# Altium schematic sheet DigitalVoltage_SignalConditioning.SchDoc
size A4; CompanyName: Technische Hochschule Nürnberg Georg Simon Ohm; Address1: Fürther Straße 250; Address2: 90429 Nürnberg; Address3: GERMANY; CompanyName2: Institut ELSYS
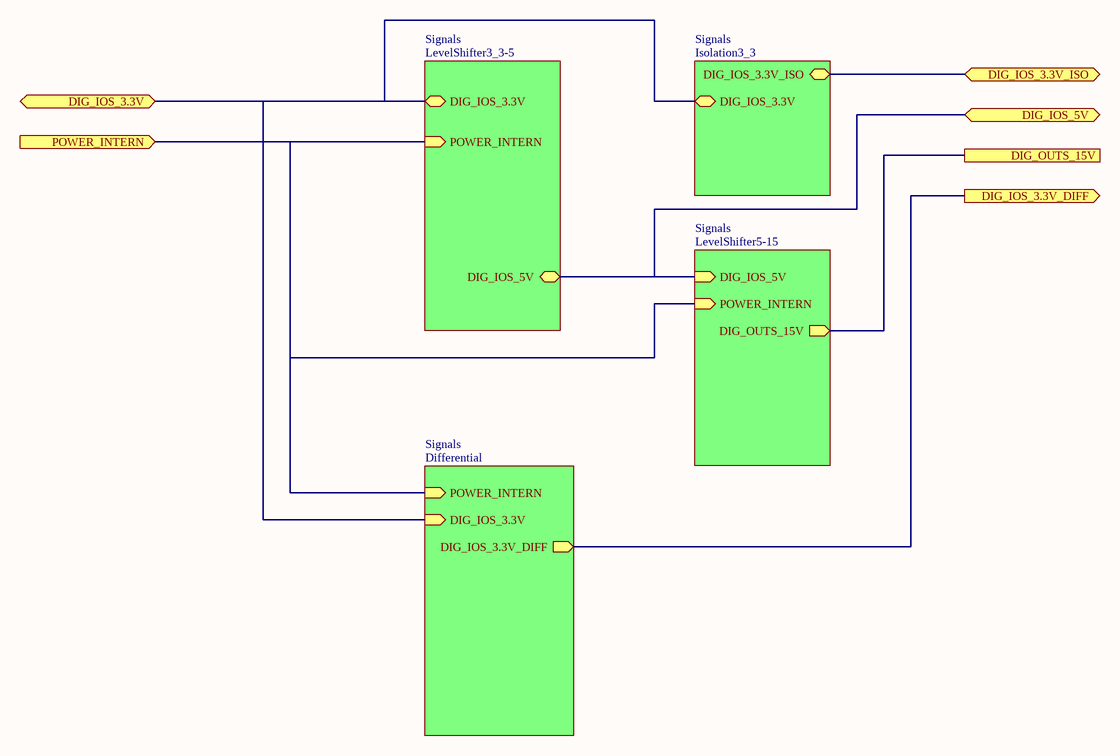
[diagram p0: DigitalVoltage_SignalConditioning.SchDoc]

## Sub-sheets
Signals = LevelShifter3_3-5: DIG_IOS_3.3V (bidir), POWER_INTERN (in), DIG_IOS_5V (bidir)
Signals = LevelShifter5-15: DIG_IOS_5V (in), POWER_INTERN (in), DIG_OUTS_15V (out)
Signals = Differential: POWER_INTERN (in), DIG_IOS_3.3V (in), DIG_IOS_3.3V_DIFF (out)
Signals = Isolation3_3: DIG_IOS_3.3V_ISO (bidir), DIG_IOS_3.3V (bidir)

## Ports
DIG_IOS_3.3V (bidir), DIG_IOS_3.3V_DIFF (out), DIG_IOS_3.3V_ISO (bidir), DIG_IOS_5V (bidir), DIG_OUTS_15V, POWER_INTERN (in)

## Buses and harness runs
bus port DIG_IOS_3.3V = sheet Signals/DIG_IOS_3.3V
bus port DIG_IOS_3.3V_DIFF = sheet Signals/DIG_IOS_3.3V_DIFF
bus port DIG_IOS_3.3V_ISO = sheet Signals/DIG_IOS_3.3V_ISO
bus port DIG_IOS_5V = sheet Signals/DIG_IOS_5V
bus port DIG_OUTS_15V = sheet Signals/DIG_OUTS_15V
bus port POWER_INTERN = sheet Signals/POWER_INTERN

## Notes on the sheet
- Title
- Size:
- Date:
- A4
- Revision:
- Time:
- Sheet
- of
- Author:
- Project: